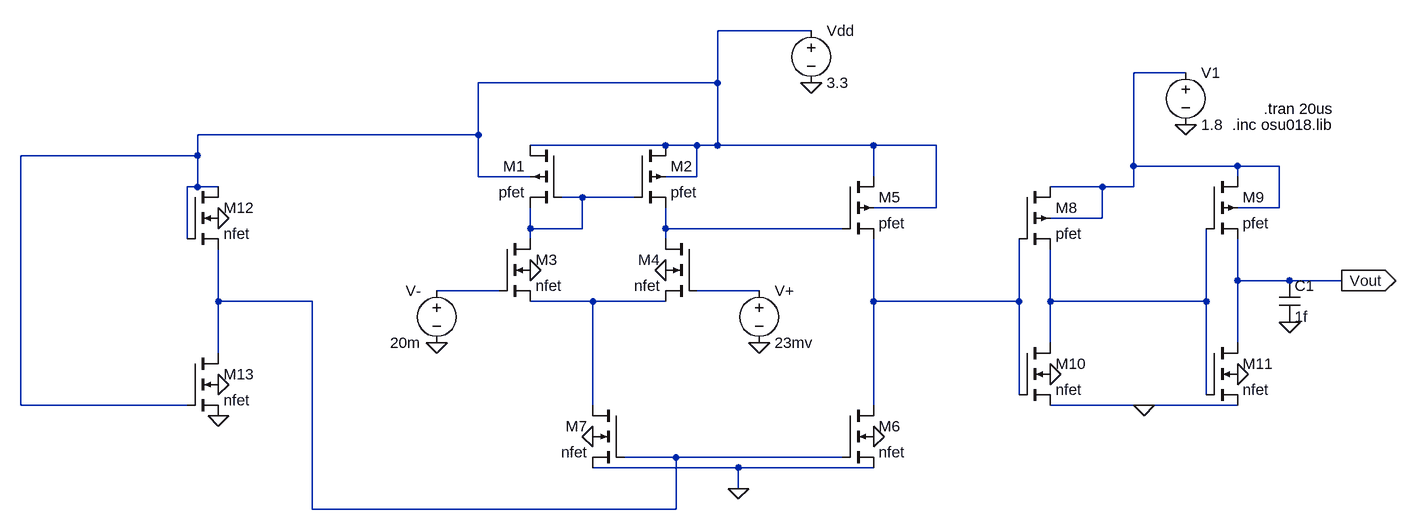
[diagram p0: schematic Comparator2stageFinal.asc]
Comparator2stageFinal.asc, the LTspice schematic file:
Version 4
SHEET 1 1472 680
WIRE 544 -272 400 -272
WIRE 1120 -208 1040 -208
WIRE 400 -192 400 -272
WIRE 400 -192 32 -192
WIRE 32 -112 32 -192
WIRE 32 -112 -400 -112
WIRE 320 -96 112 -96
WIRE 368 -96 320 -96
WIRE 400 -96 400 -192
WIRE 400 -96 368 -96
WIRE 640 -96 400 -96
WIRE 736 -96 640 -96
WIRE -400 -80 -400 -112
WIRE -400 -80 -672 -80
WIRE 1040 -64 1040 -208
WIRE 1200 -64 1040 -64
WIRE 1264 -64 1200 -64
WIRE 32 -48 32 -112
WIRE 112 -48 32 -48
WIRE 368 -48 368 -96
WIRE 368 -48 320 -48
WIRE 640 -48 640 -96
WIRE 1200 -48 1200 -64
WIRE -400 -32 -400 -80
WIRE -400 -32 -416 -32
WIRE -368 -32 -400 -32
WIRE 992 -32 912 -32
WIRE 1040 -32 1040 -64
WIRE 1040 -32 992 -32
WIRE 192 -16 160 -16
WIRE 272 -16 192 -16
WIRE 736 0 736 -96
WIRE 736 0 640 0
WIRE 1264 0 1264 -64
WIRE 1264 0 1200 0
WIRE 992 16 992 -32
WIRE 992 16 912 16
WIRE 112 32 112 0
WIRE 192 32 192 -16
WIRE 192 32 112 32
WIRE 320 32 320 0
WIRE 592 32 320 32
WIRE -416 48 -416 -32
WIRE 112 48 112 32
WIRE 320 48 320 32
WIRE 1200 112 1200 48
WIRE 1280 112 1200 112
WIRE 1360 112 1280 112
WIRE 64 128 -32 128
WIRE 464 128 368 128
WIRE -368 144 -368 64
WIRE -224 144 -368 144
WIRE 208 144 112 144
WIRE 320 144 208 144
WIRE 640 144 640 48
WIRE 864 144 864 48
WIRE 864 144 640 144
WIRE 912 144 912 64
WIRE 1152 144 1152 32
WIRE 1152 144 912 144
WIRE 912 208 912 144
WIRE 1200 208 1200 112
WIRE -368 224 -368 144
WIRE 864 288 864 144
WIRE 1152 288 1152 144
WIRE -672 304 -672 -80
WIRE -416 304 -672 304
WIRE 208 304 208 144
WIRE 640 304 640 144
WIRE 1056 304 912 304
WIRE 1200 304 1056 304
WIRE 336 384 256 384
WIRE 592 384 336 384
WIRE 432 400 208 400
WIRE 640 400 432 400
WIRE 432 432 432 400
WIRE -224 464 -224 144
WIRE 336 464 336 384
WIRE 336 464 -224 464
FLAG 464 208 0
FLAG -32 208 0
FLAG 432 432 0
FLAG 544 -192 0
FLAG 112 96 0
FLAG 320 96 0
FLAG 208 352 0
FLAG 640 352 0
FLAG 1120 -128 0
FLAG 1056 304 0
FLAG 912 256 0
FLAG 1200 256 0
FLAG 1360 112 Vout
IOPIN 1360 112 Out
FLAG 1280 176 0
FLAG -368 16 0
FLAG -368 272 0
FLAG -368 320 0
SYMBOL pmos4 160 -96 M0
SYMATTR InstName M1
SYMATTR Value pfet
SYMATTR Value2 l=180n w=240n m=1
SYMBOL pmos4 272 -96 R0
SYMATTR InstName M2
SYMATTR Value pfet
SYMATTR Value2 l=200n w=240n m=1
SYMBOL nmos4 64 48 R0
SYMATTR InstName M3
SYMATTR Value nfet
SYMATTR Value2 l=200n w=240n m=1
SYMBOL nmos4 368 48 M0
SYMATTR InstName M4
SYMATTR Value nfet
SYMATTR Value2 l=200n w=240n m=1
SYMBOL voltage 464 112 R0
WINDOW 123 0 0 Left 0
WINDOW 39 0 0 Left 0
SYMATTR InstName V+
SYMATTR Value 23mv
SYMBOL voltage -32 112 M0
WINDOW 123 0 0 Left 0
WINDOW 39 0 0 Left 0
SYMATTR InstName V-
SYMATTR Value 20m
SYMBOL pmos4 592 -48 R0
SYMATTR InstName M5
SYMATTR Value pfet
SYMATTR Value2 l=200n w=240n m=1
SYMBOL nmos4 592 304 R0
SYMATTR InstName M6
SYMATTR Value nfet
SYMATTR Value2 l=200n w=240n m=1
SYMBOL nmos4 256 304 M0
SYMATTR InstName M7
SYMATTR Value nfet
SYMATTR Value2 l=200n w=240n m=1
SYMBOL voltage 544 -288 R0
WINDOW 123 0 0 Left 0
WINDOW 39 0 0 Left 0
SYMATTR InstName Vdd
SYMATTR Value 3.3
SYMBOL pmos4 864 -32 R0
SYMATTR InstName M8
SYMATTR Value pfet
SYMATTR Value2 l=200n w=240n
SYMBOL pmos4 1152 -48 R0
SYMATTR InstName M9
SYMATTR Value pfet
SYMATTR Value2 l=200n w=240n
SYMBOL nmos4 864 208 R0
SYMATTR InstName M10
SYMATTR Value nfet
SYMATTR Value2 l=200n w=240n
SYMBOL nmos4 1152 208 R0
SYMATTR InstName M11
SYMATTR Value nfet
SYMATTR Value2 l=200n w=240n
SYMBOL voltage 1120 -224 R0
WINDOW 123 0 0 Left 0
WINDOW 39 0 0 Left 0
SYMATTR InstName V1
SYMATTR Value 1.8
SYMBOL cap 1264 112 R0
SYMATTR InstName C1
SYMATTR Value 1f
SYMBOL nmos4 -416 -32 R0
SYMATTR InstName M12
SYMATTR Value nfet
SYMATTR Value2 l=0.2u w=0.24u
SYMBOL nmos4 -416 224 R0
SYMATTR InstName M13
SYMATTR Value nfet
SYMATTR Value2 l=0.2u w=2.5u
TEXT 1240 -152 Left 2 !.tran 20us
TEXT 1192 -128 Left 2 !.inc osu018.lib

The netlist it stands for:
* Comparator2stageFinal.asc
M1 N001 N003 N003 N001 pfet l=180n w=240n m=1
M2 N001 N003 N004 N001 pfet l=200n w=240n m=1
M3 N003 N005 N008 0 nfet l=200n w=240n m=1
M4 N004 N006 N008 0 nfet l=200n w=240n m=1
V+ N006 0 23mv
V- N005 0 20m
M5 N001 N004 N009 N001 pfet l=200n w=240n m=1
M6 N009 N007 0 0 nfet l=200n w=240n m=1
M7 N008 N007 0 0 nfet l=200n w=240n m=1
Vdd N001 0 3.3
M8 N002 N009 N010 N002 pfet l=200n w=240n
M9 N002 N010 Vout N002 pfet l=200n w=240n
M10 N010 N009 0 0 nfet l=200n w=240n
M11 Vout N010 0 0 nfet l=200n w=240n
V1 N002 0 1.8
C1 Vout 0 1f
M12 N001 N001 N007 0 nfet l=0.2u w=0.24u
M13 N007 N001 0 0 nfet l=0.2u w=2.5u
.model NMOS NMOS
.model PMOS PMOS
.lib standard.mos
.tran 20us
.inc osu018.lib
.backanno
.end